# Altium schematic sheet QO100_RX_IDU.SchDoc
size A4
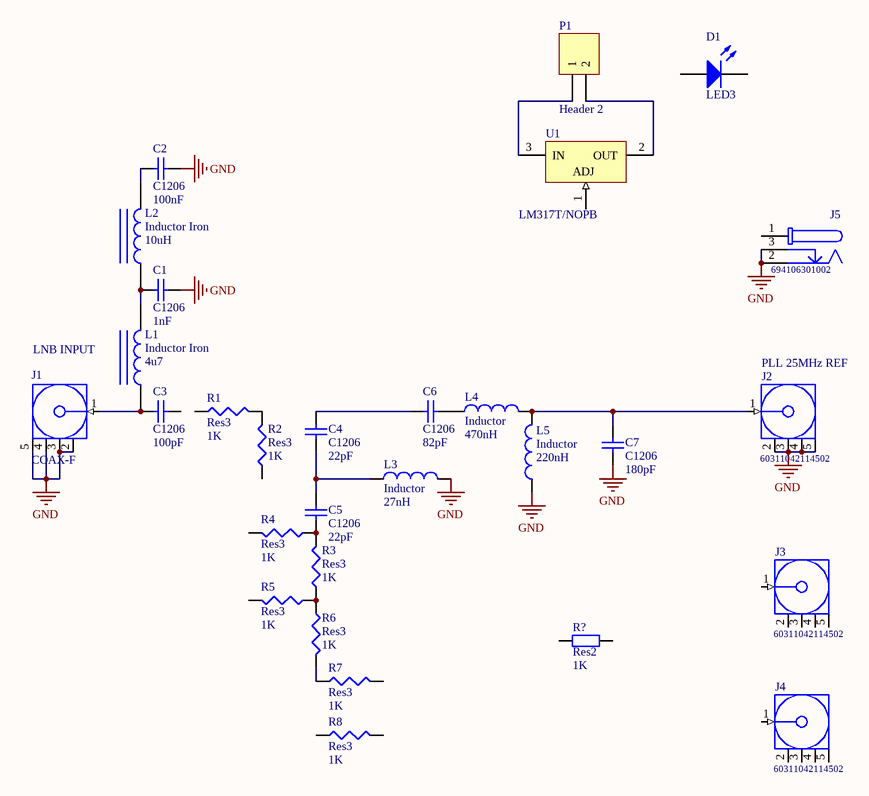
[diagram p0: QO100_RX_IDU.SchDoc]

## Parts
C1  C1206  value 1nF  [1206]
C2  C1206  value 100nF  [1206]
C3  C1206  value 100pF  [1206]
C4  C1206  value 22pF  [1206]
C5  C1206  value 22pF  [1206]
C6  C1206  value 82pF  [1206]
C7  C1206  value 180pF  [1206]
D1  LED3  [3.5X2.8X1.9]
J1  COAX-F  [MCX5.08-H5]
J2  60311042114502  [60311042114502]
J3  60311042114502  [60311042114502]
J4  60311042114502  [60311042114502]
J5  694106301002  [694106301002]
L1  Inductor Iron  value 4u7  [AXIAL-0.9]
L2  Inductor Iron  value 10uH  [AXIAL-0.9]
L3  Inductor  value 27nH  [INDC1608L]
L4  Inductor  value 470nH  [INDC1608L]
L5  Inductor  value 220nH  [INDC1608L]
P1  Header 2  [HDR1X2]
R1  Res3  value 1K  [14-1210]
R2  Res3  value 1K  [14-1210]
R3  Res3  value 1K  [14-1210]
R4  Res3  value 1K  [14-1210]
R5  Res3  value 1K  [14-1210]
R6  Res3  value 1K  [14-1210]
R7  Res3  value 1K  [14-1210]
R8  Res3  value 1K  [14-1210]
R?  Res2  value 1K  [AXIAL-0.4]
U1  LM317T/NOPB  [T03B]

## Nets
GND: C1.1 C2.1 C7.1 J1.2(GND) J1.3(GND) J1.4(GND) J1.5(GND) J2.2(GND) J2.3(GND) J2.4(GND) J2.5(GND) J5.2 J5.3 L3.2 L5.1
NetC1_2: C1.2 L1.2 L2.1
NetC2_2: C2.2 L2.2
NetC3_2: C3.2 J1.1(Signal) L1.1
NetC4_1: C4.1 C6.1
NetC4_2: C4.2 C5.1 L3.1
NetC5_2: C5.2 R3.2 R4.1
NetC6_2: C6.2 L4.1
NetC7_2: C7.2 J2.1(Signal) L4.2 L5.2
NetP1_1: P1.1 U1.3(IN)
NetP1_2: P1.2 U1.2(OUT)
NetR1_2: R1.2 R2.2
NetR3_1: R3.1 R5.1 R6.1
NetR6_2: R6.2 R7.1

Not connected (* = marked no-connect by the designer): C3 1; D1 1(A) 2(K); J3 1(Signal) 2(GND) 3(GND) 4(GND) 5(GND); J4 1(Signal) 2(GND) 3(GND) 4(GND) 5(GND); J5 1; R1 1; R2 1; R4 2; R5 2; R7 2; R8 1 2; R? 1 2; U1 1(ADJ)

## Notes on the sheet
- LNB INPUT
- (near J2) PLL 25MHz REF

## Library data of the parts
C1-C7 = C1206: Ceramic Chip Capacitor - Standard; Published: 17-Jul-2002; LatestRevisionDate: 19-Mar-2004; LatestRevisionNote: Silkscreen size reduced.; DatasheetDocument: Mar-2001; PackageDocument: Mar-2001; PackageReference: 1206; Publisher: Altium Limited; Code_JEITA: 1206; Code_IPC: 3216 [1206]; ComponentLink1Description: Manufacturer Link; ComponentLink1URL: http://www.kemet.com/; ComponentLink2Description: Datasheet; ComponentLink2URL: http://www.kemet.com/kemet/web/homepage/kechome.nsf/vapubfilesname/F3102TA.pdf/$file/F3102TA.pdf
D1 = LED3: Typical BLUE SiC LED; Published: 8-Jun-2000; LatestRevisionDate: 17-Dec-2003; LatestRevisionNote: PCB Footprint replaced.; DatasheetVersion: 16-Apr-2002; PackageVersion: 16-Apr-2002; PackageReference: 3.5X2.8X1.9; Publisher: Altium Limited; PackageDescription: SM LED; 2 C-Bend Leads; Body 3.5 x 2.8 x 1.9 mm, inc leads (LxWxH typ)
J1 = COAX-F: RF Coaxial PCB Connector, MCX; Thru-Hole, Right-Angle Mount Socket, Blunt Post Terminal, 50 Ohm Impedance; PCB_Layout: Complies with manufacturer's recommendation.; DrillSize: Corresponds to nominal value.; Published: 15-Jul-2004; LatestRevisionDate: 15-Jul-2004; LatestRevisionNote: Component Replaced.; DatasheetDocument: 30-May-2003; PackageDocument: 04-Jul-1999; PackageReference: 919-119J-51AX; Publisher: Altium Limited; ComponentLink1Description: Manufacturer Link; ComponentLink1URL: http://www.amphenolrf.com/
J2-J4 = 60311042114502: WR-SMA SMA PCB THT Jack Right Angle Rear Mount Bulkhead; Impedance: 50 Ohm; Frequency Range: DC~12.4 GHz; ComponentLink1Description: Manufacturer; ComponentLink1URL: http://www.we-online.de; ComponentLink2Description: Datasheet; ComponentLink2URL: https://katalog.we-online.de/em/datasheet/60311042114502.pdf; Part Number: 60311042114502; Published Date: August 2018; Publisher: Wurth Elektronik; Operating Temperature: -65 to 165 degC; Gender: Jack; Packaging: Tray; Connector Type: SMA; Orientation Type: Right Angle; Mounting Technology: THT
J5 = 694106301002: DC Power Jack Connector WR-DC, Male, Right Angled, THT, 5 A, 24 V; Opening Diameter: 6.4 mm; Plug Inner Diameter: 2.05 mm; Plug Outer Diameter: 5.5 mm; Rated Current: 5 A; Working Voltage: 24 V; ComponentLink1Description: Manufacturer; ComponentLink1URL: http://www.we-online.de; ComponentLink2Description: Datasheet; ComponentLink2URL: http://katalog.we-online.de/em/datasheet/6941xx301002.pdf; Part Number: 694106301002; Published Date: August 2018; Publisher: Wurth Elektronik; Orientation: Right Angled; Operating Temperature: -40 to 85 degC; Mounting Technology: THT; Gender: Male; Packaging: Bag
L1 L2 = Inductor Iron: Magnetic-Core Inductor; Published: 24-Mar-1999; LatestRevisionDate: 17-Jul-2002; LatestRevisionNote: Re-released for DXP Platform.; PackageReference: AXIAL-0.9; Publisher: Altium Limited; PackageDescription: Axial Device, Thru-Hole; 2 Leads; 0.9 in Pin Spacing
L3-L5 = Inductor: Code_IEC: 1005; Published: 8-Jun-2000; LatestRevisionDate: 29-May-2009; LatestRevisionNote: IPC-7351 Footprint Added.; PackageReference: 0402-A; Publisher: Altium Limited; PackageDescription: Chip Inductor; Code_JEITA: 0402
P1 = Header 2: Header, 2-Pin; LatestRevisionDate: 17-Jul-2002; LatestRevisionNote: Re-released for DXP Platform.; Publisher: Altium Limited
R1-R8 = Res3: Resistor; Published: 8-Jun-2000; LatestRevisionDate: 29-May-2009; LatestRevisionNote: IPC-7351 Footprint Added.; PackageReference: J1-0603; Publisher: Altium Limited; PackageDescription: Chip Resistor
R? = Res2: Resistor; Published: 8-Jun-2000; LatestRevisionDate: 17-Jul-2002; LatestRevisionNote: Re-released for DXP Platform.; PackageReference: AXIAL-0.4; Publisher: Altium Limited; PackageDescription: Axial Device, Thru-Hole; 2 Leads; 0.4 in Pin Spacing
U1 = LM317T/NOPB: 3-Terminal Adjustable Regulator, 3-pin TO-220, Pb-Free; Manufacturer: National Semiconductor; PackageTopMarking: NSUZXYTTE#*LM317T P+; PowerWise: N; CompType: LDO IC; High-Reliability: Y; DatasheetVersion: Apr-2007; PackageVersion: revL, Jan-1992; PackageReference: T03B; PackageDescription: TO-220, Molded, 3 Lead, Straight; PartNumber: LM317T/NOPB; RoHS: Y; PinCount: 3; ComponentLink1Description: Manufacturer URL; ComponentLink1URL: http://www.national.com/; ComponentLink2Description: LM317 Datasheet; ComponentLink2URL: http://www.national.com/ds/LM/LM317.pdf; ComponentLink3Description: LM317 Web Page; ComponentLink3URL: http://www.national.com/pf/LM/LM317.html; ComponentLink4Description: T03B Package Page; ComponentLink4URL: http://www.national.com/packaging/folders/t03b.html